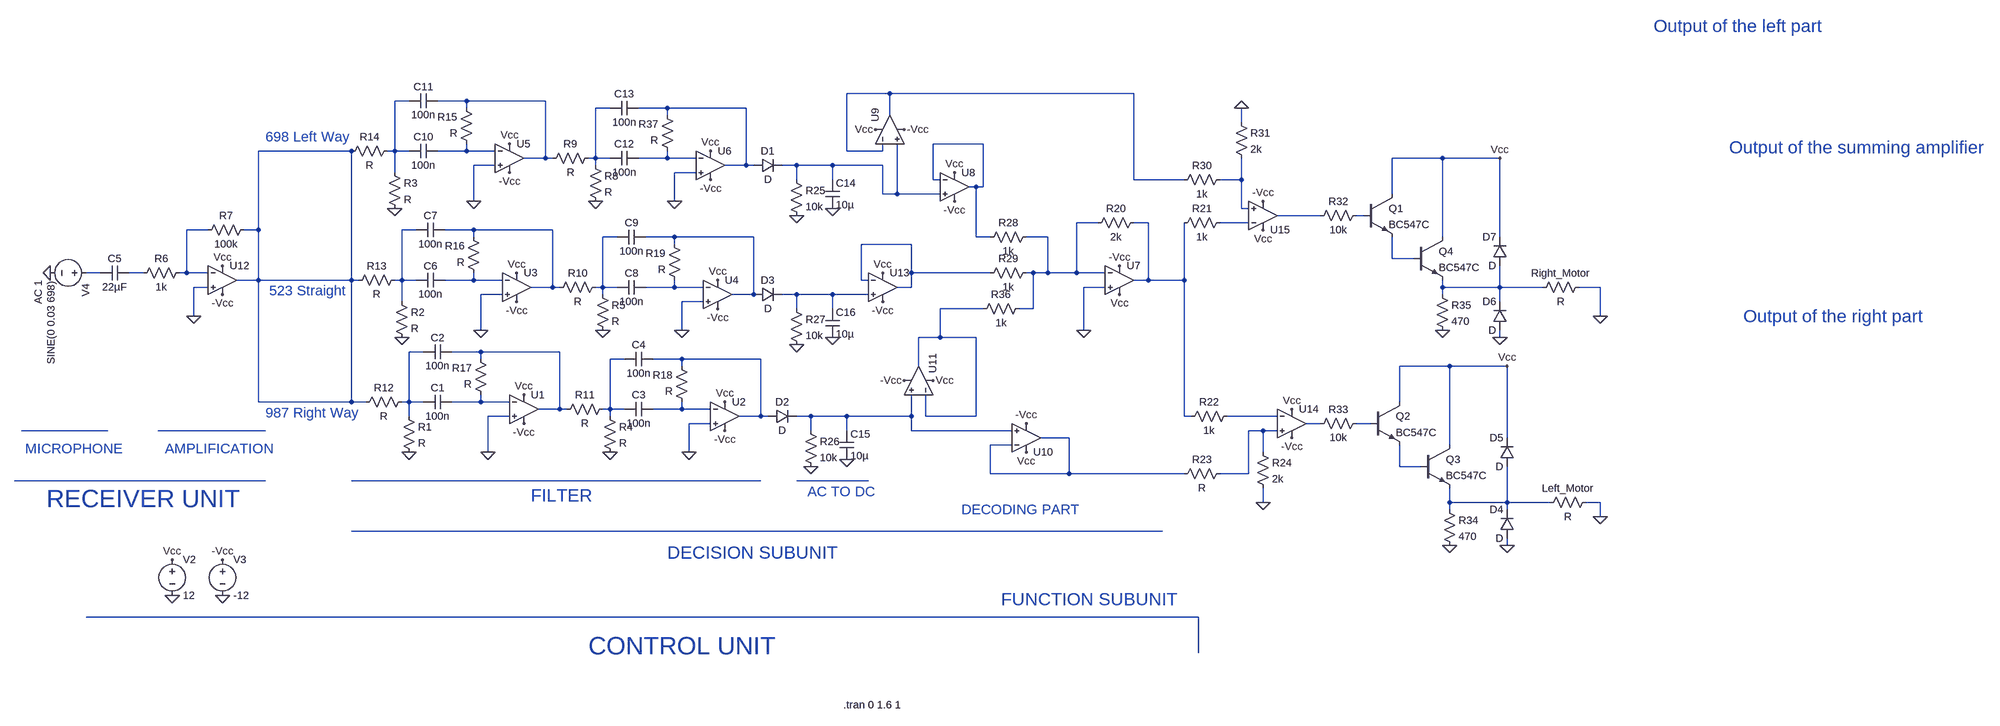
[diagram p0: schematic This-is-the-one_Ver2.asc]
This-is-the-one_Ver2.asc, the LTspice schematic file:
Version 4
SHEET 1 4472 1424
WIRE -256 -2032 -352 -2032
WIRE 288 -2032 -256 -2032
WIRE -1328 -2016 -1360 -2016
WIRE -1200 -2016 -1264 -2016
WIRE -1024 -2016 -1200 -2016
WIRE -1200 -2000 -1200 -2016
WIRE -880 -2000 -912 -2000
WIRE -752 -2000 -816 -2000
WIRE -576 -2000 -752 -2000
WIRE -752 -1984 -752 -2000
WIRE -256 -1984 -256 -2032
WIRE 528 -1968 528 -2000
WIRE -48 -1920 -160 -1920
WIRE -1456 -1904 -1664 -1904
WIRE -1360 -1904 -1360 -2016
WIRE -1360 -1904 -1376 -1904
WIRE -1328 -1904 -1360 -1904
WIRE -1200 -1904 -1200 -1920
WIRE -1200 -1904 -1264 -1904
WIRE -1136 -1904 -1200 -1904
WIRE -352 -1904 -352 -2032
WIRE -272 -1904 -272 -1920
WIRE -272 -1904 -352 -1904
WIRE -1024 -1888 -1024 -2016
WIRE -1024 -1888 -1072 -1888
WIRE -1008 -1888 -1024 -1888
WIRE -912 -1888 -912 -2000
WIRE -912 -1888 -928 -1888
WIRE -880 -1888 -912 -1888
WIRE -752 -1888 -752 -1904
WIRE -752 -1888 -816 -1888
WIRE -688 -1888 -752 -1888
WIRE 976 -1888 864 -1888
WIRE 1104 -1888 976 -1888
WIRE -1136 -1872 -1184 -1872
WIRE -912 -1872 -912 -1888
WIRE -576 -1872 -576 -2000
WIRE -576 -1872 -624 -1872
WIRE -560 -1872 -576 -1872
WIRE -464 -1872 -496 -1872
WIRE -384 -1872 -464 -1872
WIRE -272 -1872 -384 -1872
WIRE -1360 -1856 -1360 -1904
WIRE -688 -1856 -736 -1856
WIRE -464 -1840 -464 -1872
WIRE -384 -1840 -384 -1872
WIRE -160 -1840 -160 -1920
WIRE -144 -1840 -160 -1840
WIRE 288 -1840 288 -2032
WIRE 400 -1840 288 -1840
WIRE 528 -1840 528 -1888
WIRE 528 -1840 480 -1840
WIRE -64 -1824 -80 -1824
WIRE -48 -1824 -48 -1920
WIRE -48 -1824 -64 -1824
WIRE -272 -1808 -272 -1872
WIRE -240 -1808 -240 -1920
WIRE -240 -1808 -272 -1808
WIRE -144 -1808 -240 -1808
WIRE 864 -1808 864 -1888
WIRE -1184 -1792 -1184 -1872
WIRE -736 -1792 -736 -1856
WIRE 528 -1776 528 -1840
WIRE 544 -1776 528 -1776
WIRE 704 -1760 608 -1760
WIRE 800 -1760 784 -1760
WIRE 208 -1744 160 -1744
WIRE 320 -1744 288 -1744
WIRE 544 -1744 480 -1744
WIRE -1776 -1728 -1824 -1728
WIRE -1664 -1728 -1664 -1904
WIRE -1664 -1728 -1696 -1728
WIRE -1312 -1728 -1344 -1728
WIRE -1184 -1728 -1248 -1728
WIRE -1008 -1728 -1184 -1728
WIRE -1184 -1712 -1184 -1728
WIRE -864 -1712 -896 -1712
WIRE -736 -1712 -800 -1712
WIRE -560 -1712 -736 -1712
WIRE -64 -1712 -64 -1824
WIRE -32 -1712 -64 -1712
WIRE 96 -1712 48 -1712
WIRE 976 -1712 976 -1888
WIRE 1104 -1712 1104 -1888
WIRE -736 -1696 -736 -1712
WIRE -208 -1696 -320 -1696
WIRE 864 -1664 864 -1712
WIRE 912 -1664 864 -1664
WIRE -2016 -1632 -2048 -1632
WIRE -1920 -1632 -1952 -1632
WIRE -1824 -1632 -1824 -1728
WIRE -1824 -1632 -1840 -1632
WIRE -1776 -1632 -1824 -1632
WIRE -208 -1632 -208 -1696
WIRE -32 -1632 -208 -1632
WIRE 64 -1632 48 -1632
WIRE 96 -1632 96 -1712
WIRE 96 -1632 64 -1632
WIRE 160 -1632 160 -1744
WIRE 160 -1632 96 -1632
WIRE 224 -1632 160 -1632
WIRE -1664 -1616 -1664 -1728
WIRE -1664 -1616 -1712 -1616
WIRE -1456 -1616 -1456 -1904
WIRE -1456 -1616 -1664 -1616
WIRE -1440 -1616 -1456 -1616
WIRE -1344 -1616 -1344 -1728
WIRE -1344 -1616 -1360 -1616
WIRE -1312 -1616 -1344 -1616
WIRE -1184 -1616 -1184 -1632
WIRE -1184 -1616 -1248 -1616
WIRE -1120 -1616 -1184 -1616
WIRE -320 -1616 -320 -1696
WIRE -304 -1616 -320 -1616
WIRE 320 -1616 320 -1744
WIRE 320 -1616 288 -1616
WIRE 400 -1616 400 -1744
WIRE 400 -1616 320 -1616
WIRE -1776 -1600 -1808 -1600
WIRE -1008 -1600 -1008 -1728
WIRE -1008 -1600 -1056 -1600
WIRE -992 -1600 -1008 -1600
WIRE -896 -1600 -896 -1712
WIRE -896 -1600 -912 -1600
WIRE -864 -1600 -896 -1600
WIRE -736 -1600 -736 -1616
WIRE -736 -1600 -800 -1600
WIRE -672 -1600 -736 -1600
WIRE -208 -1600 -208 -1632
WIRE -208 -1600 -240 -1600
WIRE 224 -1600 176 -1600
WIRE 976 -1600 976 -1616
WIRE 1104 -1600 1104 -1648
WIRE 1104 -1600 976 -1600
WIRE 1200 -1600 1104 -1600
WIRE 1328 -1600 1280 -1600
WIRE -1120 -1584 -1168 -1584
WIRE -896 -1584 -896 -1600
WIRE -560 -1584 -560 -1712
WIRE -560 -1584 -608 -1584
WIRE -544 -1584 -560 -1584
WIRE -464 -1584 -496 -1584
WIRE -384 -1584 -464 -1584
WIRE -304 -1584 -384 -1584
WIRE 976 -1584 976 -1600
WIRE -1344 -1568 -1344 -1616
WIRE -672 -1568 -720 -1568
WIRE 1104 -1568 1104 -1600
WIRE -464 -1552 -464 -1584
WIRE -384 -1552 -384 -1584
WIRE -48 -1552 -144 -1552
WIRE 64 -1552 64 -1632
WIRE 64 -1552 32 -1552
WIRE -1808 -1536 -1808 -1600
WIRE 1328 -1536 1328 -1600
WIRE -1168 -1504 -1168 -1584
WIRE -720 -1504 -720 -1568
WIRE 176 -1504 176 -1600
WIRE -144 -1488 -144 -1552
WIRE -144 -1488 -192 -1488
WIRE -64 -1488 -144 -1488
WIRE 1104 -1488 1104 -1504
WIRE -1296 -1456 -1328 -1456
WIRE -1168 -1456 -1232 -1456
WIRE -992 -1456 -1168 -1456
WIRE -1168 -1440 -1168 -1456
WIRE -848 -1440 -880 -1440
WIRE -720 -1440 -784 -1440
WIRE -544 -1440 -720 -1440
WIRE -720 -1424 -720 -1440
WIRE -192 -1424 -192 -1488
WIRE 992 -1424 880 -1424
WIRE 1120 -1424 992 -1424
WIRE -1664 -1344 -1664 -1616
WIRE -1456 -1344 -1456 -1616
WIRE -1456 -1344 -1664 -1344
WIRE -1424 -1344 -1456 -1344
WIRE -1328 -1344 -1328 -1456
WIRE -1328 -1344 -1344 -1344
WIRE -1296 -1344 -1328 -1344
WIRE -1168 -1344 -1168 -1360
WIRE -1168 -1344 -1232 -1344
WIRE -1104 -1344 -1168 -1344
WIRE 880 -1344 880 -1424
WIRE -992 -1328 -992 -1456
WIRE -992 -1328 -1040 -1328
WIRE -976 -1328 -992 -1328
WIRE -880 -1328 -880 -1440
WIRE -880 -1328 -896 -1328
WIRE -848 -1328 -880 -1328
WIRE -720 -1328 -720 -1344
WIRE -720 -1328 -784 -1328
WIRE -656 -1328 -720 -1328
WIRE -1328 -1312 -1328 -1344
WIRE -1104 -1312 -1152 -1312
WIRE -880 -1312 -880 -1328
WIRE -544 -1312 -544 -1440
WIRE -544 -1312 -592 -1312
WIRE -528 -1312 -544 -1312
WIRE -432 -1312 -464 -1312
WIRE -352 -1312 -432 -1312
WIRE -208 -1312 -208 -1360
WIRE -208 -1312 -352 -1312
WIRE -176 -1312 -176 -1360
WIRE -64 -1312 -64 -1488
WIRE -64 -1312 -176 -1312
WIRE 400 -1312 400 -1616
WIRE 416 -1312 400 -1312
WIRE 608 -1312 496 -1312
WIRE -656 -1296 -704 -1296
WIRE 704 -1296 672 -1296
WIRE 816 -1296 784 -1296
WIRE -2000 -1280 -2192 -1280
WIRE -1648 -1280 -1888 -1280
WIRE -432 -1280 -432 -1312
WIRE -352 -1280 -352 -1312
WIRE -208 -1280 -208 -1312
WIRE 16 -1280 -208 -1280
WIRE 576 -1280 544 -1280
WIRE 608 -1280 576 -1280
WIRE 144 -1264 80 -1264
WIRE 1120 -1264 1120 -1424
WIRE 16 -1248 -32 -1248
WIRE 992 -1248 992 -1424
WIRE -1152 -1232 -1152 -1312
WIRE -704 -1232 -704 -1296
WIRE 576 -1232 576 -1280
WIRE 880 -1200 880 -1248
WIRE 928 -1200 880 -1200
WIRE -32 -1184 -32 -1248
WIRE 144 -1184 144 -1264
WIRE 144 -1184 -32 -1184
WIRE 400 -1184 144 -1184
WIRE 544 -1184 544 -1280
WIRE 544 -1184 480 -1184
WIRE -1648 -1168 -2208 -1168
WIRE -544 -1168 -1456 -1168
WIRE -304 -1168 -464 -1168
WIRE 576 -1120 576 -1152
WIRE 992 -1120 992 -1152
WIRE 1120 -1120 1120 -1200
WIRE 1120 -1120 992 -1120
WIRE 1216 -1120 1120 -1120
WIRE 1328 -1120 1296 -1120
WIRE 992 -1104 992 -1120
WIRE 1120 -1104 1120 -1120
WIRE 1328 -1088 1328 -1120
WIRE 352 -1056 -1456 -1056
WIRE 1120 -1024 1120 -1040
WIRE 432 -864 -2048 -864
WIRE 432 -784 432 -864
FLAG -1328 -1232 0
FLAG -2128 -1632 0
FLAG -1072 -1296 -Vcc
FLAG -1152 -1232 0
FLAG -880 -1232 0
FLAG -624 -1344 Vcc
FLAG -624 -1280 -Vcc
FLAG -704 -1232 0
FLAG -1344 -1488 0
FLAG -1088 -1632 Vcc
FLAG -1088 -1568 -Vcc
FLAG -1168 -1504 0
FLAG -896 -1504 0
FLAG -640 -1616 Vcc
FLAG -640 -1552 -Vcc
FLAG -720 -1504 0
FLAG -1360 -1776 0
FLAG -1104 -1920 Vcc
FLAG -1104 -1856 -Vcc
FLAG -1184 -1792 0
FLAG -912 -1792 0
FLAG -656 -1904 Vcc
FLAG -656 -1840 -Vcc
FLAG -736 -1792 0
FLAG -464 -1472 0
FLAG -384 -1488 0
FLAG -352 -1216 0
FLAG -432 -1200 0
FLAG -464 -1760 0
FLAG -384 -1776 0
FLAG -1808 -1536 0
FLAG -1744 -1584 -Vcc
FLAG -1072 -1360 Vcc
FLAG -1744 -1648 Vcc
FLAG -1856 -992 Vcc
FLAG -1744 -992 -Vcc
FLAG -1856 -912 0
FLAG -1744 -912 0
FLAG 256 -1584 Vcc
FLAG 256 -1648 -Vcc
FLAG -288 -1952 Vcc
FLAG -224 -1952 -Vcc
FLAG 48 -1232 Vcc
FLAG 48 -1296 -Vcc
FLAG -112 -1856 Vcc
FLAG -112 -1792 -Vcc
FLAG -160 -1392 Vcc
FLAG -224 -1392 -Vcc
FLAG -272 -1632 Vcc
FLAG -272 -1568 -Vcc
FLAG 176 -1504 0
FLAG 640 -1264 -Vcc
FLAG 640 -1328 Vcc
FLAG 576 -1792 -Vcc
FLAG 576 -1728 Vcc
FLAG 576 -1120 0
FLAG 528 -2000 0
FLAG 976 -1504 0
FLAG 992 -1024 0
FLAG 1120 -1024 0
FLAG 1104 -1488 0
FLAG 1328 -1088 0
FLAG 1328 -1536 0
FLAG 1120 -1424 Vcc
FLAG 1104 -1888 Vcc
SYMBOL cap -1232 -1360 R90
WINDOW 0 0 32 VBottom 2
WINDOW 3 32 32 VTop 2
SYMATTR InstName C1
SYMATTR Value 100n
SYMBOL cap -1232 -1472 R90
WINDOW 0 0 32 VBottom 2
WINDOW 3 32 32 VTop 2
SYMATTR InstName C2
SYMATTR Value 100n
SYMBOL Opamps\\UniversalOpamp2 -1072 -1328 R0
SYMATTR InstName U1
SYMBOL cap -784 -1344 R90
WINDOW 0 0 32 VBottom 2
WINDOW 3 32 32 VTop 2
SYMATTR InstName C3
SYMATTR Value 100n
SYMBOL cap -784 -1456 R90
WINDOW 0 0 32 VBottom 2
WINDOW 3 32 32 VTop 2
SYMATTR InstName C4
SYMATTR Value 100n
SYMBOL Opamps\\UniversalOpamp2 -624 -1312 R0
SYMATTR InstName U2
SYMBOL voltage -2032 -1632 R90
WINDOW 3 17 94 Left 2
WINDOW 123 17 122 Left 2
WINDOW 39 0 0 Left 2
SYMATTR Value SINE(0 0.03 698)
SYMATTR Value2 AC 1
SYMATTR InstName V4
SYMBOL cap -1248 -1632 R90
WINDOW 0 0 32 VBottom 2
WINDOW 3 32 32 VTop 2
SYMATTR InstName C6
SYMATTR Value 100n
SYMBOL cap -1248 -1744 R90
WINDOW 0 0 32 VBottom 2
WINDOW 3 32 32 VTop 2
SYMATTR InstName C7
SYMATTR Value 100n
SYMBOL Opamps\\UniversalOpamp2 -1088 -1600 R0
SYMATTR InstName U3
SYMBOL cap -800 -1616 R90
WINDOW 0 0 32 VBottom 2
WINDOW 3 32 32 VTop 2
SYMATTR InstName C8
SYMATTR Value 100n
SYMBOL cap -800 -1728 R90
WINDOW 0 0 32 VBottom 2
WINDOW 3 32 32 VTop 2
SYMATTR InstName C9
SYMATTR Value 100n
SYMBOL Opamps\\UniversalOpamp2 -640 -1584 R0
SYMATTR InstName U4
SYMBOL cap -1264 -1920 R90
WINDOW 0 0 32 VBottom 2
WINDOW 3 32 32 VTop 2
SYMATTR InstName C10
SYMATTR Value 100n
SYMBOL cap -1264 -2032 R90
WINDOW 0 0 32 VBottom 2
WINDOW 3 32 32 VTop 2
SYMATTR InstName C11
SYMATTR Value 100n
SYMBOL Opamps\\UniversalOpamp2 -1104 -1888 R0
SYMATTR InstName U5
SYMBOL cap -816 -1904 R90
WINDOW 0 0 32 VBottom 2
WINDOW 3 32 32 VTop 2
SYMATTR InstName C12
SYMATTR Value 100n
SYMBOL cap -816 -2016 R90
WINDOW 0 0 32 VBottom 2
WINDOW 3 32 32 VTop 2
SYMATTR InstName C13
SYMATTR Value 100n
SYMBOL Opamps\\UniversalOpamp2 -656 -1872 R0
SYMATTR InstName U6
SYMBOL diode -560 -1856 R270
WINDOW 0 32 32 VTop 2
WINDOW 3 0 32 VBottom 2
SYMATTR InstName D1
SYMBOL diode -528 -1296 R270
WINDOW 0 32 32 VTop 2
WINDOW 3 0 32 VBottom 2
SYMATTR InstName D2
SYMBOL diode -560 -1568 R270
WINDOW 0 32 32 VTop 2
WINDOW 3 0 32 VBottom 2
SYMATTR InstName D3
SYMBOL res -480 -1856 R0
SYMATTR InstName R25
SYMATTR Value 10k
SYMBOL res -448 -1296 R0
SYMATTR InstName R26
SYMATTR Value 10k
SYMBOL res -480 -1568 R0
SYMATTR InstName R27
SYMATTR Value 10k
SYMBOL cap -400 -1840 R0
SYMATTR InstName C14
SYMATTR Value 10µ
SYMBOL cap -368 -1280 R0
SYMATTR InstName C15
SYMATTR Value 10µ
SYMBOL cap -400 -1552 R0
SYMATTR InstName C16
SYMATTR Value 10µ
SYMBOL Opamps\\UniversalOpamp2 -1744 -1616 R0
SYMATTR InstName U12
SYMBOL res -1824 -1648 R90
WINDOW 0 0 56 VBottom 2
WINDOW 3 32 56 VTop 2
SYMATTR InstName R6
SYMATTR Value 1k
SYMBOL res -1680 -1744 R90
WINDOW 0 0 56 VBottom 2
WINDOW 3 32 56 VTop 2
SYMATTR InstName R7
SYMATTR Value 100k
SYMBOL voltage -1856 -1008 R0
WINDOW 123 0 0 Left 2
WINDOW 39 0 0 Left 2
SYMATTR InstName V2
SYMATTR Value 12
SYMBOL voltage -1744 -1008 R0
WINDOW 123 0 0 Left 2
WINDOW 39 0 0 Left 2
SYMATTR InstName V3
SYMATTR Value -12
SYMBOL Opamps\\UniversalOpamp2 256 -1616 R0
SYMATTR InstName U7
SYMBOL res 64 -1728 R90
WINDOW 0 0 56 VBottom 2
WINDOW 3 32 56 VTop 2
SYMATTR InstName R28
SYMATTR Value 1k
SYMBOL res 64 -1648 R90
WINDOW 0 0 56 VBottom 2
WINDOW 3 32 56 VTop 2
SYMATTR InstName R29
SYMATTR Value 1k
SYMBOL Opamps\\UniversalOpamp2 -256 -1952 R270
SYMATTR InstName U9
SYMBOL Opamps\\UniversalOpamp2 48 -1264 M180
SYMATTR InstName U10
SYMBOL res 48 -1568 R90
WINDOW 0 0 56 VBottom 2
WINDOW 3 32 56 VTop 2
SYMATTR InstName R36
SYMATTR Value 1k
SYMBOL Opamps\\UniversalOpamp2 -112 -1824 R0
SYMATTR InstName U8
SYMBOL Opamps\\UniversalOpamp2 -192 -1392 M270
SYMATTR InstName U11
SYMBOL Opamps\\UniversalOpamp2 -272 -1600 R0
SYMATTR InstName U13
SYMBOL cap -1952 -1648 R90
WINDOW 0 0 32 VBottom 2
WINDOW 3 32 32 VTop 2
SYMATTR InstName C5
SYMATTR Value 22µF
SYMBOL res 304 -1760 R90
WINDOW 0 0 56 VBottom 2
WINDOW 3 32 56 VTop 2
SYMATTR InstName R20
SYMATTR Value 2k
SYMBOL Opamps\\UniversalOpamp2 640 -1296 R0
SYMATTR InstName U14
SYMBOL Opamps\\UniversalOpamp2 576 -1760 M180
SYMATTR InstName U15
SYMBOL res 496 -1760 R90
WINDOW 0 0 56 VBottom 2
WINDOW 3 32 56 VTop 2
SYMATTR InstName R21
SYMATTR Value 1k
SYMBOL res 512 -1328 R90
WINDOW 0 0 56 VBottom 2
WINDOW 3 32 56 VTop 2
SYMATTR InstName R22
SYMATTR Value 1k
SYMBOL res 496 -1200 R90
WINDOW 0 0 56 VBottom 2
WINDOW 3 32 56 VTop 2
SYMATTR InstName R23
SYMBOL res 560 -1248 R0
SYMATTR InstName R24
SYMATTR Value 2k
SYMBOL res 496 -1856 R90
WINDOW 0 0 56 VBottom 2
WINDOW 3 32 56 VTop 2
SYMATTR InstName R30
SYMATTR Value 1k
SYMBOL res 512 -1984 R0
SYMATTR InstName R31
SYMATTR Value 2k
SYMBOL res 800 -1776 R90
WINDOW 0 0 56 VBottom 2
WINDOW 3 32 56 VTop 2
SYMATTR InstName R32
SYMATTR Value 10k
SYMBOL res 800 -1312 R90
WINDOW 0 0 56 VBottom 2
WINDOW 3 32 56 VTop 2
SYMATTR InstName R33
SYMATTR Value 10k
SYMBOL npn 800 -1808 R0
SYMATTR InstName Q1
SYMATTR Value BC547C
SYMBOL npn 816 -1344 R0
SYMATTR InstName Q2
SYMATTR Value BC547C
SYMBOL npn 928 -1248 R0
SYMATTR InstName Q3
SYMATTR Value BC547C
SYMBOL npn 912 -1712 R0
SYMATTR InstName Q4
SYMATTR Value BC547C
SYMBOL res 976 -1120 R0
SYMATTR InstName R34
SYMATTR Value 470
SYMBOL res 960 -1600 R0
SYMATTR InstName R35
SYMATTR Value 470
SYMBOL diode 1136 -1040 R180
WINDOW 0 24 64 Left 2
WINDOW 3 24 0 Left 2
SYMATTR InstName D4
SYMBOL diode 1136 -1200 R180
WINDOW 0 24 64 Left 2
WINDOW 3 24 0 Left 2
SYMATTR InstName D5
SYMBOL diode 1120 -1504 R180
WINDOW 0 24 64 Left 2
WINDOW 3 24 0 Left 2
SYMATTR InstName D6
SYMBOL diode 1120 -1648 R180
WINDOW 0 24 64 Left 2
WINDOW 3 24 0 Left 2
SYMATTR InstName D7
SYMBOL res 1296 -1616 R90
WINDOW 0 0 56 VBottom 2
WINDOW 3 32 56 VTop 2
SYMATTR InstName Right_Motor
SYMBOL res 1312 -1136 R90
WINDOW 0 0 56 VBottom 2
WINDOW 3 32 56 VTop 2
SYMATTR InstName Left_Motor
SYMBOL res -1344 -1328 R0
SYMATTR InstName R1
SYMBOL res -1360 -1584 R0
SYMATTR InstName R2
SYMBOL res -1376 -1872 R0
SYMATTR InstName R3
SYMBOL res -896 -1328 R0
SYMATTR InstName R4
SYMBOL res -912 -1600 R0
SYMATTR InstName R5
SYMBOL res -928 -1888 R0
SYMATTR InstName R8
SYMBOL res -912 -1904 R90
WINDOW 0 0 56 VBottom 2
WINDOW 3 32 56 VTop 2
SYMATTR InstName R9
SYMBOL res -896 -1616 R90
WINDOW 0 0 56 VBottom 2
WINDOW 3 32 56 VTop 2
SYMATTR InstName R10
SYMBOL res -880 -1344 R90
WINDOW 0 0 56 VBottom 2
WINDOW 3 32 56 VTop 2
SYMATTR InstName R11
SYMBOL res -1328 -1360 R90
WINDOW 0 0 56 VBottom 2
WINDOW 3 32 56 VTop 2
SYMATTR InstName R12
SYMBOL res -1344 -1632 R90
WINDOW 0 0 56 VBottom 2
WINDOW 3 32 56 VTop 2
SYMATTR InstName R13
SYMBOL res -1360 -1920 R90
WINDOW 0 0 56 VBottom 2
WINDOW 3 32 56 VTop 2
SYMATTR InstName R14
SYMBOL res -1184 -1904 R180
WINDOW 0 36 76 Left 2
WINDOW 3 36 40 Left 2
SYMATTR InstName R15
SYMBOL res -1168 -1616 R180
WINDOW 0 36 76 Left 2
WINDOW 3 36 40 Left 2
SYMATTR InstName R16
SYMBOL res -1152 -1344 R180
WINDOW 0 36 76 Left 2
WINDOW 3 36 40 Left 2
SYMATTR InstName R17
SYMBOL res -704 -1328 R180
WINDOW 0 36 76 Left 2
WINDOW 3 36 40 Left 2
SYMATTR InstName R18
SYMBOL res -720 -1600 R180
WINDOW 0 36 76 Left 2
WINDOW 3 36 40 Left 2
SYMATTR InstName R19
SYMBOL res -736 -1888 R180
WINDOW 0 36 76 Left 2
WINDOW 3 36 40 Left 2
SYMATTR InstName R37
TEXT -1648 -1936 Left 3 ;698 Left Way
TEXT -1640 -1592 Left 3 ;523 Straight
TEXT -1648 -1320 Left 3 ;987 Right Way
TEXT -360 552 Left 2 !.tran 0 1.6 1
TEXT 2384 -2208 Left 4 ;Output of the left part
TEXT 2552 -1912 Left 4 ;Output of the summing amplifier
TEXT 2584 -1536 Left 4 ;Output of the right part
TEXT -1056 -1136 Left 4 ;FILTER
TEXT -1872 -1240 Left 3 ;AMPLIFICATION
TEXT -2184 -1240 Left 3 ;MICROPHONE
TEXT -2136 -1128 Left 5 ;RECEIVER UNIT
TEXT -440 -1144 Left 3 ;AC TO DC
TEXT -96 -1104 Left 3 ;DECODING PART
TEXT -752 -1008 Left 4 ;DECISION SUBUNIT
TEXT -8 -904 Left 4 ;FUNCTION SUBUNIT
TEXT -928 -800 Left 5 ;CONTROL UNIT

The netlist it stands for:
* This-is-the-one_Ver2.asc
C1 N035 N031 100n
C2 N032 N031 100n
XU1 0 N035 Vcc -Vcc N032 level.2 Avol=1Meg GBW=10Meg Slew=10Meg ilimit=25m rail=0 Vos=0 phimargin=45 en=0 enk=0 in=0 ink=0 Rin=500Meg  ; pins IN+ IN- V+ V- OUT
C3 N036 N033 100n
C4 N034 N033 100n
XU2 0 N036 Vcc -Vcc N034 level.2 Avol=1Meg GBW=10Meg Slew=10Meg ilimit=25m rail=0 Vos=0 phimargin=45 en=0 enk=0 in=0 ink=0 Rin=500Meg  ; pins IN+ IN- V+ V- OUT
V4 N024 0 SINE(0 0.03 698) AC 1
C6 N026 N018 100n
C7 N019 N018 100n
XU3 0 N026 Vcc -Vcc N019 level.2 Avol=1Meg GBW=10Meg Slew=10Meg ilimit=25m rail=0 Vos=0 phimargin=45 en=0 enk=0 in=0 ink=0 Rin=500Meg  ; pins IN+ IN- V+ V- OUT
C8 N027 N020 100n
C9 N021 N020 100n
XU4 0 N027 Vcc -Vcc N021 level.2 Avol=1Meg GBW=10Meg Slew=10Meg ilimit=25m rail=0 Vos=0 phimargin=45 en=0 enk=0 in=0 ink=0 Rin=500Meg  ; pins IN+ IN- V+ V- OUT
C10 N008 N002 100n
C11 N003 N002 100n
XU5 0 N008 Vcc -Vcc N003 level.2 Avol=1Meg GBW=10Meg Slew=10Meg ilimit=25m rail=0 Vos=0 phimargin=45 en=0 enk=0 in=0 ink=0 Rin=500Meg  ; pins IN+ IN- V+ V- OUT
C12 N009 N004 100n
C13 N005 N004 100n
XU6 0 N009 Vcc -Vcc N005 level.2 Avol=1Meg GBW=10Meg Slew=10Meg ilimit=25m rail=0 Vos=0 phimargin=45 en=0 enk=0 in=0 ink=0 Rin=500Meg  ; pins IN+ IN- V+ V- OUT
D1 N005 N010 D
D2 N034 N037 D
D3 N021 N029 D
R25 N010 0 10k
R26 N037 0 10k
R27 N029 0 10k
C14 N010 0 10µ
C15 N037 0 10µ
C16 N029 0 10µ
XU12 0 N017 Vcc -Vcc N007 level.2 Avol=1Meg GBW=10Meg Slew=10Meg ilimit=25m rail=0 Vos=0 phimargin=45 en=0 enk=0 in=0 ink=0 Rin=500Meg  ; pins IN+ IN- V+ V- OUT
R6 N017 N025 1k
R7 N007 N017 100k
V2 Vcc 0 12
V3 -Vcc 0 -12
XU7 0 N014 -Vcc Vcc N015 level.2 Avol=1Meg GBW=10Meg Slew=10Meg ilimit=25m rail=0 Vos=0 phimargin=45 en=0 enk=0 in=0 ink=0 Rin=500Meg  ; pins IN+ IN- V+ V- OUT
R28 N014 N006 1k
R29 N014 N022 1k
XU9 N010 N001 Vcc -Vcc N001 level.2 Avol=1Meg GBW=10Meg Slew=10Meg ilimit=25m rail=0 Vos=0 phimargin=45 en=0 enk=0 in=0 ink=0 Rin=500Meg  ; pins IN+ IN- V+ V- OUT
XU10 N037 N044 Vcc -Vcc N044 level.2 Avol=1Meg GBW=10Meg Slew=10Meg ilimit=25m rail=0 Vos=0 phimargin=45 en=0 enk=0 in=0 ink=0 Rin=500Meg  ; pins IN+ IN- V+ V- OUT
R36 N014 N030 1k
XU8 N010 N006 Vcc -Vcc N006 level.2 Avol=1Meg GBW=10Meg Slew=10Meg ilimit=25m rail=0 Vos=0 phimargin=45 en=0 enk=0 in=0 ink=0 Rin=500Meg  ; pins IN+ IN- V+ V- OUT
XU11 N037 N030 Vcc -Vcc N030 level.2 Avol=1Meg GBW=10Meg Slew=10Meg ilimit=25m rail=0 Vos=0 phimargin=45 en=0 enk=0 in=0 ink=0 Rin=500Meg  ; pins IN+ IN- V+ V- OUT
XU13 N029 N022 Vcc -Vcc N022 level.2 Avol=1Meg GBW=10Meg Slew=10Meg ilimit=25m rail=0 Vos=0 phimargin=45 en=0 enk=0 in=0 ink=0 Rin=500Meg  ; pins IN+ IN- V+ V- OUT
C5 N025 N024 22µF
R20 N015 N014 2k
XU14 N043 N038 Vcc -Vcc N039 level.2 Avol=1Meg GBW=10Meg Slew=10Meg ilimit=25m rail=0 Vos=0 phimargin=45 en=0 enk=0 in=0 ink=0 Rin=500Meg  ; pins IN+ IN- V+ V- OUT
XU15 N011 N016 Vcc -Vcc N012 level.2 Avol=1Meg GBW=10Meg Slew=10Meg ilimit=25m rail=0 Vos=0 phimargin=45 en=0 enk=0 in=0 ink=0 Rin=500Meg  ; pins IN+ IN- V+ V- OUT
R21 N016 N015 1k
R22 N038 N015 1k
R23 N043 N044 R
R24 N043 0 2k
R30 N011 N001 1k
R31 0 N011 2k
R32 N013 N012 10k
R33 N040 N039 10k
Q1 Vcc N013 N023 0 BC547C
Q2 Vcc N040 N045 0 BC547C
Q3 Vcc N045 N049 0 BC547C
Q4 Vcc N023 N028 0 BC547C
R34 N049 0 470
R35 N028 0 470
D4 0 N049 D
D5 N049 Vcc D
D6 0 N028 D
D7 N028 Vcc D
Right_Motor 0 N028 R
R§Left_Motor 0 N049 R
R1 N031 0 R
R2 N018 0 R
R3 N002 0 R
R4 N033 0 R
R5 N020 0 R
R8 N004 0 R
R9 N004 N003 R
R10 N020 N019 R
R11 N033 N032 R
R12 N031 N007 R
R13 N018 N007 R
R14 N002 N007 R
R15 N008 N003 R
R16 N026 N019 R
R17 N035 N032 R
R18 N036 N034 R
R19 N027 N021 R
R37 N009 N005 R
.model D D
.lib standard.dio
.model NPN NPN
.model PNP PNP
.lib standard.bjt
* 698 Left Way
* 523 Straight
* 987 Right Way
.tran 0 1.6 1
* Output of the left part
* Output of the summing amplifier
* Output of the right part
* FILTER
* AMPLIFICATION
* MICROPHONE
* RECEIVER UNIT
* AC TO DC
* DECODING PART
* DECISION SUBUNIT
* FUNCTION SUBUNIT
* CONTROL UNIT
.lib UniversalOpamps2.sub
.backanno
.end